# Altium project Project Board Test SOM AM625.PrjPcb (part 3 of 7)

## Sheet eMMC&SD.SchDoc
size A2; DocumentNumber: 3; SheetNumber: 3; SheetTotal: 12
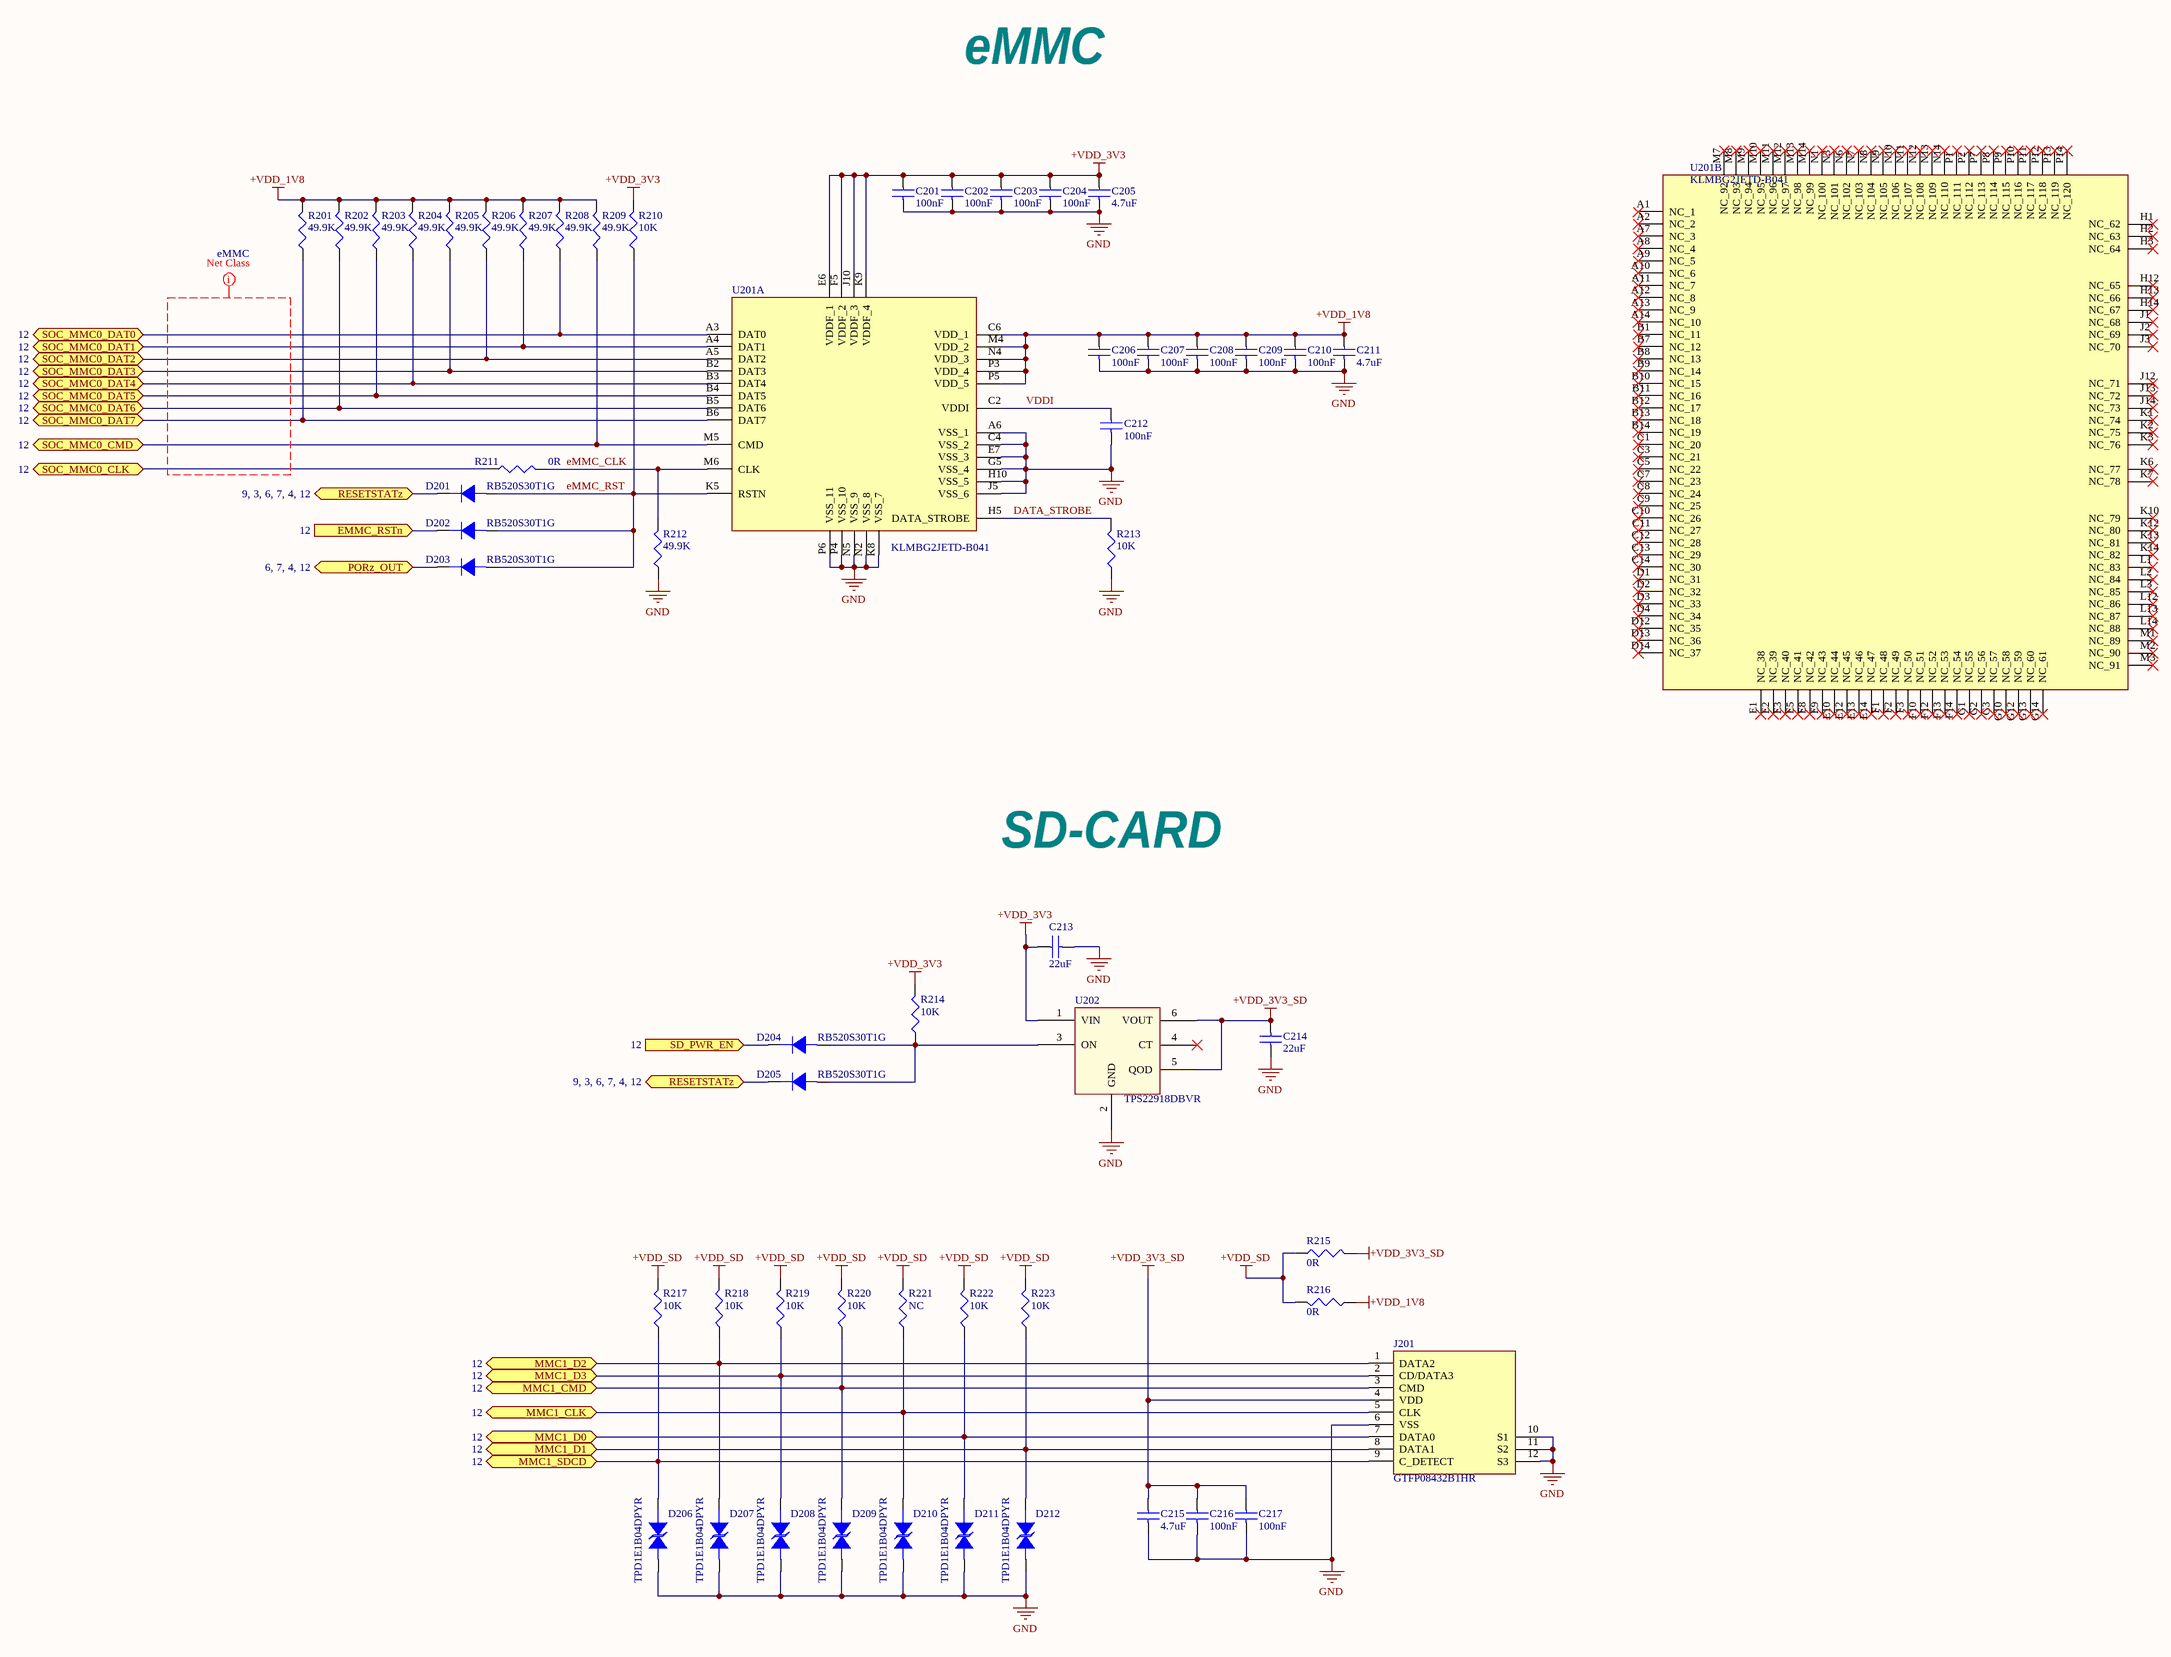
[diagram p2: eMMC&SD.SchDoc]

### Parts
C201  100nF  [C0201]
C202  100nF  [C0201]
C203  100nF  [C0201]
C204  100nF  [C0201]
C205  4.7uF  [C0402]
C206  100nF  [C0201]
C207  100nF  [C0201]
C208  100nF  [C0201]
C209  100nF  [C0201]
C210  100nF  [C0201]
C211  4.7uF  [C0402]
C212  100nF  [C0201]
C213  22uF  [C0805]
C214  22uF  [C0805]
C215  4.7uF  [C0402]
C216  100nF  [C0201]
C217  100nF  [C0201]
D201  RB520S30T1G  [sod_523]
D202  RB520S30T1G  [sod_523]
D203  RB520S30T1G  [sod_523]
D204  RB520S30T1G  [sod_523]
D205  RB520S30T1G  [sod_523]
D206  TPD1E1B04DPYR  [DIO_TPD1E05U06DPYR]
D207  TPD1E1B04DPYR  [DIO_TPD1E05U06DPYR]
D208  TPD1E1B04DPYR  [DIO_TPD1E05U06DPYR]
D209  TPD1E1B04DPYR  [DIO_TPD1E05U06DPYR]
D210  TPD1E1B04DPYR  [DIO_TPD1E05U06DPYR]
D211  TPD1E1B04DPYR  [DIO_TPD1E05U06DPYR]
D212  TPD1E1B04DPYR  [DIO_TPD1E05U06DPYR]
J201  GTFP08432B1HR  [AMPHENOL_GTFP08432B1HR]
R201  49.9K  [R0402]
R202  49.9K  [R0402]
R203  49.9K  [R0402]
R204  49.9K  [R0402]
R205  49.9K  [R0402]
R206  49.9K  [R0402]
R207  49.9K  [R0402]
R208  49.9K  [R0402]
R209  49.9K  [R0402]
R210  10K  [R0402]
R211  0R  [R0402]
R212  49.9K  [R0402]
R213  10K  [R0402]
R214  10K  [R0402]
R215  0R  [R0402]
R216  0R  [R0402]
R217  10K  [R0402]
R218  10K  [R0402]
R219  10K  [R0402]
R220  10K  [R0402]
R221  NC  [R0402]
R222  10K  [R0402]
R223  10K  [R0402]
U201  KLMBG2JETD-B041  [BGA153C50P14X14_1150X1300X80]  (parts A,B of 2)
U202  TPS22918DBVR  [SOT23-6]

### Ports
EMMC_RSTn (in, see 12), MMC1_CLK (bidir, see 12), MMC1_CMD (bidir, see 12), MMC1_D0 (bidir, see 12), MMC1_D1 (bidir, see 12), MMC1_D2 (bidir, see 12), MMC1_D3 (bidir, see 12), MMC1_SDCD (bidir, see 12), PORz_OUT (bidir, see 6, 7, 4, 12), RESETSTATz (bidir, see 9, 3, 6, 7, 4, 12), SD_PWR_EN (in, see 12), SOC_MMC0_CLK (bidir, see 12), SOC_MMC0_CMD (bidir, see 12), SOC_MMC0_DAT0 (bidir, see 12), SOC_MMC0_DAT1 (bidir, see 12), SOC_MMC0_DAT2 (bidir, see 12), SOC_MMC0_DAT3 (bidir, see 12), SOC_MMC0_DAT4 (bidir, see 12), SOC_MMC0_DAT5 (bidir, see 12), SOC_MMC0_DAT6 (bidir, see 12), SOC_MMC0_DAT7 (bidir, see 12)

### Nets
+VDD_1V8: C206.1 C207.1 C208.1 C209.1 C210.1 C211.1 R201.2 R202.2 R203.2 R204.2 R205.2 R206.2 R207.2 R208.2 R209.2 R216.1 U201.C6(VDD_1) U201.M4(VDD_2) U201.N4(VDD_3) U201.P3(VDD_4) U201.P5(VDD_5)
+VDD_3V3: C201.1 C202.1 C203.1 C204.1 C205.1 C213.1 R210.2 R214.2 U201.E6(VDDF_1) U201.F5(VDDF_2) U201.J10(VDDF_3) U201.K9(VDDF_4) U202.1(VIN)
+VDD_3V3_SD: C214.2 C215.1 C216.1 C217.1 J201.4(VDD) R215.2 U202.5(QOD) U202.6(VOUT)
+VDD_SD: R215.1 R216.2 R217.2 R218.2 R219.2 R220.2 R221.2 R222.2 R223.2
GND: C201.2 C202.2 C203.2 C204.2 C205.2 C206.2 C207.2 C208.2 C209.2 C210.2 C211.2 C212.2 C213.2 C214.1 C215.2 C216.2 C217.2 D206.1 D207.1 D208.1 D209.1 D210.1 D211.1 D212.1 J201.6(VSS) J201.10(S1) J201.11(S2) J201.12(S3) R212.1 R213.1 U201.A6(VSS_1) U201.C4(VSS_2) U201.E7(VSS_3) U201.G5(VSS_4) U201.H10(VSS_5) U201.J5(VSS_6) U201.K8(VSS_7) U201.N2(VSS_8) U201.N5(VSS_9) U201.P4(VSS_10) U201.P6(VSS_11) U202.2(GND)
DATA_STROBE: R213.2 U201.H5(DATA_STROBE)
eMMC_CLK: R211.2 R212.2 U201.M6(CLK)
eMMC_RST: D201.1(A) D202.1(A) D203.1(A) R210.1 U201.K5(RSTN)
EMMC_RSTn: D202.2(C) ; port EMMC_RSTn
MMC1_CLK: D210.2 J201.5(CLK) R221.1 ; port MMC1_CLK
MMC1_CMD: D209.2 J201.3(CMD) R220.1 ; port MMC1_CMD
MMC1_D0: D211.2 J201.7(DATA0) R222.1 ; port MMC1_D0
MMC1_D1: D212.2 J201.8(DATA1) R223.1 ; port MMC1_D1
MMC1_D2: D207.2 J201.1(DATA2) R218.1 ; port MMC1_D2
MMC1_D3: D208.2 J201.2(CD/DATA3) R219.1 ; port MMC1_D3
MMC1_SDCD: D206.2 J201.9(C_DETECT) R217.1 ; port MMC1_SDCD
PORz_OUT: D203.2(C) ; port PORz_OUT
RESETSTATz: D201.2(C) D205.2(C) ; port RESETSTATz
SD_PWR_EN: D204.2(C) ; port SD_PWR_EN
SOC_MMC0_CLK: R211.1 ; port SOC_MMC0_CLK
SOC_MMC0_CMD: R209.1 U201.M5(CMD) ; port SOC_MMC0_CMD
SOC_MMC0_DAT0: R208.1 U201.A3(DAT0) ; port SOC_MMC0_DAT0
SOC_MMC0_DAT1: R207.1 U201.A4(DAT1) ; port SOC_MMC0_DAT1
SOC_MMC0_DAT2: R206.1 U201.A5(DAT2) ; port SOC_MMC0_DAT2
SOC_MMC0_DAT3: R205.1 U201.B2(DAT3) ; port SOC_MMC0_DAT3
SOC_MMC0_DAT4: R204.1 U201.B3(DAT4) ; port SOC_MMC0_DAT4
SOC_MMC0_DAT5: R203.1 U201.B4(DAT5) ; port SOC_MMC0_DAT5
SOC_MMC0_DAT6: R202.1 U201.B5(DAT6) ; port SOC_MMC0_DAT6
SOC_MMC0_DAT7: R201.1 U201.B6(DAT7) ; port SOC_MMC0_DAT7
VDDI: C212.1 U201.C2(VDDI)
NetD204_1: D204.1(A) D205.1(A) R214.1 U202.3(ON)

Not connected (* = marked no-connect by the designer): U201 A1(NC_1)* A2(NC_2)* A7(NC_3)* A8(NC_4)* A9(NC_5)* A10(NC_6)* A11(NC_7)* A12(NC_8)* A13(NC_9)* A14(NC_10)* B1(NC_11)* B7(NC_12)* B8(NC_13)* B9(NC_14)* B10(NC_15)* B11(NC_16)* B12(NC_17)* B13(NC_18)* B14(NC_19)* C1(NC_20)* C3(NC_21)* C5(NC_22)* C7(NC_23)* C8(NC_24)* C9(NC_25)* C10(NC_26)* C11(NC_27)* C12(NC_28)* C13(NC_29)* C14(NC_30)* D1(NC_31)* D2(NC_32)* D3(NC_33)* D4(NC_34)* D12(NC_35)* D13(NC_36)* D14(NC_37)* E1(NC_38)* E2(NC_39)* E3(NC_40)* E5(NC_41)* E8(NC_42)* E9(NC_43)* E10(NC_44)* E12(NC_45)* E13(NC_46)* E14(NC_47)* F1(NC_48)* F2(NC_49)* F3(NC_50)* F10(NC_51)* F12(NC_52)* F13(NC_53)* F14(NC_54)* G1(NC_55)* G2(NC_56)* G3(NC_57)* G10(NC_58)* G12(NC_59)* G13(NC_60)* G14(NC_61)* H1(NC_62)* H2(NC_63)* H3(NC_64)* H12(NC_65)* H13(NC_66)* H14(NC_67)* J1(NC_68)* J2(NC_69)* J3(NC_70)* J12(NC_71)* J13(NC_72)* J14(NC_73)* K1(NC_74)* K2(NC_75)* K3(NC_76)* K6(NC_77)* K7(NC_78)* K10(NC_79)* K12(NC_80)* K13(NC_81)* K14(NC_82)* L1(NC_83)* L2(NC_84)* L3(NC_85)* L12(NC_86)* L13(NC_87)* L14(NC_88)* M1(NC_89)* M2(NC_90)* M3(NC_91)* M7(NC_92)* M8(NC_93)* M9(NC_94)* M10(NC_95)* M11(NC_96)* M12(NC_97)* M13(NC_98)* M14(NC_99)* N1(NC_100)* N3(NC_101)* N6(NC_102)* N7(NC_103)* N8(NC_104)* N9(NC_105)* N10(NC_106)* N11(NC_107)* N12(NC_108)* N13(NC_109)* N14(NC_110)* P1(NC_111)* P2(NC_112)* P7(NC_113)* P8(NC_114)* P9(NC_115)* P10(NC_116)* P11(NC_117)* P12(NC_118)* P13(NC_119)* P14(NC_120)*; U202 4(CT)*

### Layout directives
net class eMMC: (no net found under the mark)

### Notes on the sheet
- eMMC
- SD-CARD

### Library data of the parts
C201-C204 C206-C210 C212 C216 C217 = CC0201KRX5R6BB104: Multilayer Ceramic Capacitor, 0.1 uF, 16 V, ± 10%, X5R, 0201 [0603 Metric]; Manufacturer: Yageo; Material: 4241ConductorMaterial; Voltage Rating (DC): 10V; Supplier 1: Future Electronics; Manufacturer Part Number: CC0201KRX5R6BB104; RoHS: Yes; Category: Ceramic Capacitors; Stock 1: 10410000; Pricing 1: 15000=0.0027, 60000=0.0026, 150000=0.0025, 375000=0.0024, 600000=0.0023 (USD); Mount: Surface Mount; Case/Package: 0201; Case Code (Imperial): 0201; Case Code (Metric): 0603; Weight: 6E-06oz; Min Operating Temperature: -55°C; Max Operating Temperature: 85°C; Capacitance: 100nF; Tolerance: 10%; Dielectric: X5R; Packaging: Tape and Reel; Termination: SMD/SMT; Voltage Rating: 10V; Series: CC; Construction: Flat; Length: 0.6mm; Height: 0.3mm; Depth: 0.3mm; Radiation Hardening: No; RoHS Compliant: Yes; Halogen Free: 5694HalogenFree; Lead Free: 5697LeadFree; ComponentLink1URL: https://datasheet.ciiva.com/11587/upy-gphc-x5r-4v-to-50v-12-11587190.pdf?src-supplier=Avnet; ComponentLink1Description: https://datasheet.ciiva.com/11587/upy-gphc-x5r-4v-to-50v-12-11587190.pdf?src-supplier=Avnet; Supplier Part Number 1: 5050553
C205 C211 C215 = CC0402MRX5R5BB475: Multilayer Ceramic Capacitor, 4.7 uF, 6.3V, ± 10%, X5R, 0402 [1005 Metric]; Manufacturer: Yageo; Material: 4241ConductorMaterial; Temperature Coefficient: 30ppm/°C; Supplier 1: Future Electronics; Manufacturer Part Number: CC0402MRX5R5BB475; RoHS: Yes; Category: Ceramic Capacitors; Stock 1: 240000; Pricing 1: 10000=0.0195, 20000=0.019, 40000=0.0186, 50000=0.0185, 150000=0.0176 (USD); ComponentLink1URL: http://www.mouser.com/ds/2/447/UPY-GPHC_X5R_4V-to-50V_25-1131599.pdf?src-supplier=Mouser; ComponentLink1Description: http://www.mouser.com/ds/2/447/UPY-GPHC_X5R_4V-to-50V_25-1131599.pdf?src-supplier=Mouser; ComponentLink2URL: https://datasheet.octopart.com/CC0402MRX5R5BB475-Yageo-datasheet-140260304.pdf?src-supplier=Newark; ComponentLink2Description: https://datasheet.octopart.com/CC0402MRX5R5BB475-Yageo-datasheet-140260304.pdf?src-supplier=Newark; ComponentLink3URL: https://datasheet.octopart.com/CC0402MRX5R5BB475-Yageo-datasheet-137875056.pdf?src-supplier=Future+Electronics; ComponentLink3Description: https://datasheet.octopart.com/CC0402MRX5R5BB475-Yageo-datasheet-137875056.pdf?src-supplier=Future+Electronics; ComponentLink4URL: http://www.yageo.com/documents/recent/UPY-GPHC_X5R_4V-to-50V_25.pdf?src-supplier=Digi-Key; ComponentLink4Description: http://www.yageo.com/documents/recent/UPY-GPHC_X5R_4V-to-50V_25.pdf?src-supplier=Digi-Key; ComponentLink5URL: http://www.yageo.com/exep/pages/download/literatures/ProductSelectionGuide%202014_Final_2.pdf?src-supplier=Digi-Key; ComponentLink5Description: http://www.yageo.com/exep/pages/download/literatures/ProductSelectionGuide%202014_Final_2.pdf?src-supplier=Digi-Key; ComponentLink6URL: http://www.yageo.com/documents/recent/UPY-GPHC_X5R_4V-to-50V_12.pdf?src-supplier=Avnet; ComponentLink6Description: http://www.yageo.com/documents/recent/UPY-GPHC_X5R_4V-to-50V_12.pdf?src-supplier=Avnet; ComponentLink7URL: https://datasheet.octopart.com/CC0402MRX5R5BB475-Yageo-datasheet-149070021.pdf?src-supplier=TME; ComponentLink7Description: https://datasheet.octopart.com/CC0402MRX5R5BB475-Yageo-datasheet-149070021.pdf?src-supplier=TME; Supplier Part Number 1: 7044477
C213 C214 = CC0805MKX5R8BB226: 22 µF ±20% 25V Ceramic Capacitor X5R 0805 (2012 Metric); Manufacturer: Yageo; Material: 4241ConductorMaterial; Supplier 1: Future Electronics; Manufacturer Part Number: CC0805MKX5R8BB226; RoHS: Yes; Category: Ceramic Capacitors; Stock 1: 10; Pricing 1: 1=0.375, 15=0.3, 75=0.255, 300=0.215, 1500=0.172 (USD); ComponentLink1URL: http://www.mouser.com/ds/2/447/Yageo_UPY-GP_NP0_16V-to-50V_9-358835.pdf?src-supplier=Mouser; ComponentLink1Description: http://www.mouser.com/ds/2/447/Yageo_UPY-GP_NP0_16V-to-50V_9-358835.pdf?src-supplier=Mouser; ComponentLink2URL: https://datasheet.octopart.com/CC0805MKX5R8BB226-Yageo-datasheet-137700085.pdf?src-supplier=Future+Electronics; ComponentLink2Description: https://datasheet.octopart.com/CC0805MKX5R8BB226-Yageo-datasheet-137700085.pdf?src-supplier=Future+Electronics; ComponentLink3URL: http://www.yageo.com/documents/recent/UPY-GPHC_X5R_4V-to-50V_25.pdf?src-supplier=Digi-Key; ComponentLink3Description: http://www.yageo.com/documents/recent/UPY-GPHC_X5R_4V-to-50V_25.pdf?src-supplier=Digi-Key; Supplier Part Number 1: 1151527
D201-D205 = RB520S30T1G: Diode Schottky 30V 0.2A 2-Pin SOD-523 T/R - Product that comes on tape, but is not reeled; Manufacturer: ON Semiconductor; Polarity: Standard; Current Rating: 200mA; Element Configuration: Single; Forward Voltage: 600mV; Max Reverse Leakage Current: 1uA; Power Dissipation: 200mW; Supplier 1: Future Electronics; Manufacturer Part Number: RB520S30T1G; RoHS: Yes; Category: Schottky Diodes; Stock 1: 33000; Pricing 1: 3000=0.0155, 12000=0.0148, 45000=0.0143, 90000=0.0139, 225000=0.0133 (USD); Case/Package: SOD-523-2; Number of Pins: 2; Min Operating Temperature: -55°C; Max Operating Temperature: 150°C; Packaging: Tape and Reel; Voltage Rating (DC): 30V; Output Current: 200mA; Max Repetitive Reverse Voltage (Vrrm): 30V; Package Quantity: 3000; Forward Current: 200mA; Average Rectified Current: 200mA; Max Forward Surge Current (Ifsm): 200mA; Max Reverse Current: 1uA; Max Reverse Voltage (DC): 30V; Series: -; Length: 1.3mm; Width: 0.9mm; Height: 0.7mm; Radiation Hardening: No; Reach SVHC Compliant: No; Lead Free: Lead Free; RoHS Compliant: Yes; ComponentLink1URL: https://datasheet.ciiva.com/915/rb520s30t1-d-915377.pdf?src-supplier=Avnet; ComponentLink1Description: https://datasheet.ciiva.com/915/rb520s30t1-d-915377.pdf?src-supplier=Avnet; ComponentLink2URL: https://datasheet.ciiva.com/915/rb520s30t1-d-915377.pdf?src-supplier=Digi-Key; ComponentLink2Description: https://datasheet.ciiva.com/915/rb520s30t1-d-915377.pdf?src-supplier=Digi-Key; ComponentLink3URL: https://datasheet.ciiva.com/22659/1708342-22659126.pdf?src-supplier=Element14; ComponentLink3Description: https://datasheet.ciiva.com/22659/1708342-22659126.pdf?src-supplier=Element14; ComponentLink4URL: https://datasheet.ciiva.com/4715/rb520s30t1-d-101117-4715113.pdf?src-supplier=Mouser; ComponentLink4Description: https://datasheet.ciiva.com/4715/rb520s30t1-d-101117-4715113.pdf?src-supplier=Mouser; ComponentLink5URL: https://datasheet.ciiva.com/16210/rb520s30t1-d-16210917.pdf?src-supplier=Future+Electronics; ComponentLink5Description: https://datasheet.ciiva.com/16210/rb520s30t1-d-16210917.pdf?src-supplier=Future+Electronics; ComponentLink6URL: https://datasheet.ciiva.com/8292/rb520s30t1-d-8292399.pdf?src-supplier=Avnet; ComponentLink6Description: https://datasheet.ciiva.com/8292/rb520s30t1-d-8292399.pdf?src-supplier=Avnet; ComponentLink7URL: https://datasheet.ciiva.com/915/rb520s30t1-d-915378.pdf?src-supplier=Digi-Key; ComponentLink7Description: https://datasheet.ciiva.com/915/rb520s30t1-d-915378.pdf?src-supplier=Digi-Key; ComponentLink8URL: https://datasheet.ciiva.com/915/rb520s30t1-d-915379.pdf?src-supplier=Digi-Key; ComponentLink8Description: https://datasheet.ciiva.com/915/rb520s30t1-d-915379.pdf?src-supplier=Digi-Key; Supplier Part Number 1: 7657109
D206-D212 = TPD1E1B04DPYR: 1-pF, ±3.6-V, ±30-kV ESD protection diode with 6-A 8/20-uS surge & Low Clamping in 0402 package; Manufacturer: Texas Instruments; Capacitance: 1pF; Interface: LVDS,USB,Ethernet; Number of Channels: 1; Direction: 211Direction; Breakdown Voltage: 6.4V; Clamping Voltage: 8.5V; Peak Pulse Current: 6.3A; Peak Pulse Power: 50W; Reverse Standoff Voltage: 3.6V; Supplier 1: Mouser; Manufacturer Part Number: TPD1E1B04DPYR; RoHS: Yes; Category: Integrated Circuits (ICs); Stock 1: 57724; Pricing 1: 1=0.35, 10=0.28, 50=0.28, 100=0.184, 500=0.144, 1000=0.102, 2500=0.098, 10000=0.085, 20000=0.084, 50000=0.079 (USD); Number of Pins: 2NUMBER; Min Operating Temperature: -40°C; Max Operating Temperature: 125°C; Length: 600um; Width: 1mm; Height: 450um; Thickness: 370um; Lead Free: Lead Free; RoHS Compliant: Yes; ComponentLink1URL: http://www.ti.com/lit/ds/symlink/tpd1e1b04.pdf?src-supplier=Digi-Key; ComponentLink1Description: http://www.ti.com/lit/ds/symlink/tpd1e1b04.pdf?src-supplier=Digi-Key; ComponentLink2URL: http://www.ti.com/general/docs/suppproductinfo.tsp?distId=10&amp;gotoUrl=http%3A%2F%2Fwww.ti.com%2Flit%2Fgpn%2Ftpd1e1b04&src-supplier=Digi-Key; ComponentLink2Description: http://www.ti.com/general/docs/suppproductinfo.tsp?distId=10&amp;gotoUrl=http%3A%2F%2Fwww.ti.com%2Flit%2Fgpn%2Ftpd1e1b04&src-supplier=Digi-Key; Supplier Part Number 1: 595-TPD1E1B04DPYR
J201 = CONN; MICRO SD PUSH/PUSH SMALL 8C, 5033981892: MICRO SD PUSH/PUSH SMALL 8C; MANUFACTURER1: Amphenol ICC (Commercial Products); Current Rating: 500 mA; Voltage Rating: 10 VAC/DC; Supplier 1: Digi-Key; Stock 1: 31804; Pricing 1: 1=2.53, 10=2.292, 25=2.1516, 50=2.0582, 100=1.9647, 250=1.7776, 500=1.6372, 1000=1.4033 (USD); Product Category: Memory Card Connectors; RoHS: Details; Category: CONN; Packaging: Reel; Series: 503398; Factory Pack Quantity: 2400; MANUFACTURER1_PART#: GTFP08432B1HR; ComponentLink2URL: https://datasheet.ciiva.com/16655/5033981892-memory-card-socket-16655604.pdf; LINK: https://www.digikey.com/en/products/detail/amphenol-icc-commercial-products/GTFP08432B1HR/13683218?s=N4IgTCBcDaIOIBUBiAFADADgCwGYwCEBGACQCUQBdAXyA; ComponentLink3URL: https://datasheet.ciiva.com/29723/5033981892-sd-29723401.pdf; ComponentLink3Description: https://datasheet.ciiva.com/29723/5033981892-sd-29723401.pdf; ComponentLink4URL: https://datasheet.ciiva.com/22744/1740946-22744573.pdf; ComponentLink4Description: https://datasheet.ciiva.com/22744/1740946-22744573.pdf; Supplier Part Number 1: WM11190CT-ND
R201-R209 R212 = RC0402FR-0749K9L: SMD Chip Resistor, 49.9 kOhm, ± 1%, 63 mW, 0402 [1005 Metric], Thick Film, General Purpose; Manufacturer: Yageo; Power Rating: 62.5mW; Resistance: 49.9kR; Voltage Rating: 50V; Temperature Coefficient: 100ppm/°C; Max Power Dissipation: 63mW; Supplier 1: Future Electronics; Manufacturer Part Number: RC0402FR-0749K9L; RoHS: Yes; Category: Chip SMD Resistors; Stock 1: 1990000; Pricing 1: 10000=0.0008, 50000=0.0008, 250000=0.0007, 500000=0.0007, 1500000=0.0007 (USD); Case/Package: 0402; Case Code (Imperial): 0402; Case Code (Metric): 1005; Size Code: 0402; Min Operating Temperature: -55°C; Max Operating Temperature: 155°C; Tolerance: 1%; Packaging: Tape and Reel; Termination: SMD/SMT; Voltage Rating (DC): 50V; Features: Moisture Resistant; Series: RC; Number of Terminations: 2; Construction: Rectangular; Length: 1mm; Depth: 0.5mm; RoHS Compliant: Yes; Military Standard: Not; Lead Free: Lead Free; ComponentLink1URL: https://datasheet.ciiva.com/17071/pyu-rc0402-51-rohs-l-6-r-17071066.pdf?src-supplier=Future+Electronics; ComponentLink1Description: https://datasheet.ciiva.com/17071/pyu-rc0402-51-rohs-l-6-r-17071066.pdf?src-supplier=Future+Electronics; Supplier Part Number 1: 3276235
R210 R213 R214 R217-R220 R222 R223 = RC0402FR-0710KL: RES 10.0K OHM 1/16W 1% 0402 SMD; Manufacturer: Yageo; Power (Watts): 0.063W, 1/16W; .Checked PCB: used; Temperature Coefficient: ±100ppm/°C; Category: Resistors; Supplier Part Number: 311-10.0KLRCT-ND; Manufacturer Part Number: RC0402FR-0710KL; Package / Case: 0402 (1005 Metric); Price 1k [$]: 0.01421; Resistance (Ohms): 10K; Tolerance: ±1%; Value: 10k; .Checked SCH: used; Supplier: Digikey; Supplier 1: Digi-Key; Supplier Part Number 1: 311-10.0KLRCT-ND; RoHS: RoHS Compliant; Stock 1: 2916495; Pricing 1: 10=0.014, 50=0.0104, 100=0.0079, 250=0.00584, 500=0.00432, 1000=0.00288 (USD); Composition: Thick Film; Features: -; Size / Dimension: 0.039" L x 0.020" W (1.00mm x 0.50mm); Height: 0.016" (0.40mm); Number of Terminations: 2; Packaging: Cut Tape (CT); ComponentLink1URL: http://www.yageo.com/documents/recent/PYu-RC0402_51_RoHS_L_6.pdf; ComponentLink1Description: http://www.yageo.com/documents/recent/PYu-RC0402_51_RoHS_L_6.pdf
R211 R215 R216 = RC0402JR-070RL: Zero Ohm Resistor, Jumper, 0402 [1005 Metric], Thick Film, 63 mW, 1 A, Surface Mount; Manufacturer: Yageo; Resistance: 0mR; Power Rating: 62.5mW; Tolerance: 5%; Voltage Rating: 50V; Max Power Dissipation: 63mW; Temperature Coefficient: 200ppm/°C; Supplier 1: Future Electronics; Manufacturer Part Number: RC0402JR-070RL; RoHS: Yes; Category: Chip SMD Resistors; Stock 1: 51030000; Pricing 1: 10000=0.0009, 50000=0.0008, 250000=0.0008, 500000=0.0007, 1500000=0.0007 (USD); Case/Package: 0402; Contact Plating: Tin,Matte; Case Code (Metric): 1005; Case Code (Imperial): 0402; Size Code: 0402; Min Operating Temperature: -55°C; Max Operating Temperature: 155°C; Packaging: Tape and Reel; Resistor Type: Thick Film; Number of Terminations: 2; Termination: SMD/SMT; Features: Moisture Resistant; Series: RC; Package Quantity: 1; Technology: THICK FILM; Resistance Tolerance: 5%; Construction: Rectangular; Length: 1mm; Width: 0.02inch; Height: 0.016inch; Depth: 0.5mm; Lead Free: 5697LeadFree; Reach SVHC Compliant: Unknown; RoHS Compliant: Yes; Military Standard: Not; Supplier Part Number 1: 3375797
R221 = RC0402FR-0710KL: RES 10.0K OHM 1/16W 1% 0402 SMD; Manufacturer: Yageo; Resistance (Ohms): 10K; Power (Watts): 0.063W, 1/16W; Value: 10k; .Checked PCB: used; Temperature Coefficient: ±100ppm/°C; Category: Resistors; Supplier Part Number: 311-10.0KLRCT-ND; Manufacturer Part Number: RC0402FR-0710KL; Package / Case: 0402 (1005 Metric); Price 1k [$]: 0.01421; Tolerance: ±1%; .Checked SCH: used; Supplier: Digikey; Supplier 1: Digi-Key; Supplier Part Number 1: 311-10.0KLRCT-ND; RoHS: RoHS Compliant; Stock 1: 2916495; Pricing 1: 10=0.014, 50=0.0104, 100=0.0079, 250=0.00584, 500=0.00432, 1000=0.00288 (USD); Composition: Thick Film; Features: -; Size / Dimension: 0.039" L x 0.020" W (1.00mm x 0.50mm); Height: 0.016" (0.40mm); Number of Terminations: 2; Packaging: Cut Tape (CT); ComponentLink1URL: http://www.yageo.com/documents/recent/PYu-RC0402_51_RoHS_L_6.pdf; ComponentLink1Description: http://www.yageo.com/documents/recent/PYu-RC0402_51_RoHS_L_6.pdf
U201 = KLMAG1JETD-B041: eMMC 5.1 BGA-153 eMMC ROHS; ComponentLink1Description: https://datasheet.lcsc.com/lcsc/2007011825_Samsung-KLMAG1JETD-B041_C499919.pdf; ComponentLink1URL: https://datasheet.lcsc.com/lcsc/2007011825_Samsung-KLMAG1JETD-B041_C499919.pdf
U202 = TPS22918DBVR: IC SINGLE CHANNEL LOAD SWITCH; Manufacturer: Texas Instruments; Max Supply Voltage: 5.5V; Min Supply Voltage: 1V; Output Current: 2A; Supplier 1: Mouser; Manufacturer Part Number: TPS22918DBVR; RoHS: Yes; Category: Power Management ICs; Stock 1: 70571; Pricing 1: 1=0.53, 10=0.454, 50=0.454, 100=0.34, 500=0.267, 1000=0.207, 3000=0.197, 10000=0.197 (USD); Number of Pins: 6NUMBER; Length: 2.9mm; Width: 1.6mm; Height: 1.45mm; Thickness: 1.2mm; ComponentLink1URL: http://www.ti.com/lit/gpn/tps22918?src-supplier=Mouser; ComponentLink1Description: http://www.ti.com/lit/gpn/tps22918?src-supplier=Mouser; ComponentLink2URL: http://www.ti.com/lit/ds/symlink/tps22918.pdf?src-supplier=Digi-Key; ComponentLink2Description: http://www.ti.com/lit/ds/symlink/tps22918.pdf?src-supplier=Digi-Key; ComponentLink3URL: http://www.ti.com/general/docs/suppproductinfo.tsp?distId=10&amp;gotoUrl=http%3A%2F%2Fwww.ti.com%2Flit%2Fgpn%2Ftps22918&src-supplier=Digi-Key; ComponentLink3Description: http://www.ti.com/general/docs/suppproductinfo.tsp?distId=10&amp;gotoUrl=http%3A%2F%2Fwww.ti.com%2Flit%2Fgpn%2Ftps22918&src-supplier=Digi-Key; Supplier Part Number 1: 595-TPS22918DBVR